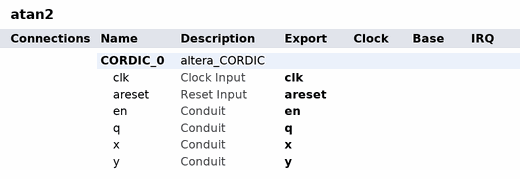
[diagram p0: system contents]
# Platform Designer (Qsys) system atan2, Arria V 5AGXMB1G4F40C4
# Parameters at their usual value, and those the tool derives, are not listed.
package require -exact qsys 23.1
create_system atan2
set_project_property DEVICE_FAMILY {Arria V}
set_project_property DEVICE 5AGXMB1G4F40C4

add_instance CORDIC_0 altera_CORDIC 23.1
set_instance_property CORDIC_0 AUTO_EXPORT true
set_instance_parameter_value CORDIC_0 ALL_function ATAN2
set_instance_parameter_value CORDIC_0 FUNCTION_FAMILY ALL
set_instance_parameter_value CORDIC_0 LUTSize 6
set_instance_parameter_value CORDIC_0 SFCompensation false
set_instance_parameter_value CORDIC_0 frequency_target 40
set_instance_parameter_value CORDIC_0 fxpt_in_fraction 0
set_instance_parameter_value CORDIC_0 fxpt_in_sign 1
set_instance_parameter_value CORDIC_0 fxpt_in_width 16
set_instance_parameter_value CORDIC_0 fxpt_out_fraction 13
set_instance_parameter_value CORDIC_0 fxpt_out_width 32
set_instance_parameter_value CORDIC_0 gen_enable true
set_instance_parameter_value CORDIC_0 latency_target 0
set_instance_parameter_value CORDIC_0 performance_goal frequency
set_instance_parameter_value CORDIC_0 report_resources_to_xml false
set_instance_parameter_value CORDIC_0 selected_device_family {Arria V}
set_instance_parameter_value CORDIC_0 selected_device_speedgrade 4_H4
set_instance_parameter_value CORDIC_0 specifyLUTs false
set_instance_parameter_value CORDIC_0 useLUTs false

# exported interfaces
add_interface areset reset sink
set_interface_property areset EXPORT_OF CORDIC_0.areset
add_interface clk clock sink
set_interface_property clk EXPORT_OF CORDIC_0.clk
add_interface en conduit end
set_interface_property en EXPORT_OF CORDIC_0.en
add_interface q conduit end
set_interface_property q EXPORT_OF CORDIC_0.q
add_interface x conduit end
set_interface_property x EXPORT_OF CORDIC_0.x
add_interface y conduit end
set_interface_property y EXPORT_OF CORDIC_0.y

set_interconnect_requirement {$system} qsys_mm.clockCrossingAdapter HANDSHAKE
set_interconnect_requirement {$system} qsys_mm.enableEccProtection FALSE
set_interconnect_requirement {$system} qsys_mm.insertDefaultSlave FALSE
set_interconnect_requirement {$system} qsys_mm.maxAdditionalLatency 1

save_system atan2.qsys
